# EAGLE schematic BE-Carrier-Example (EAGLE 7.7.0)
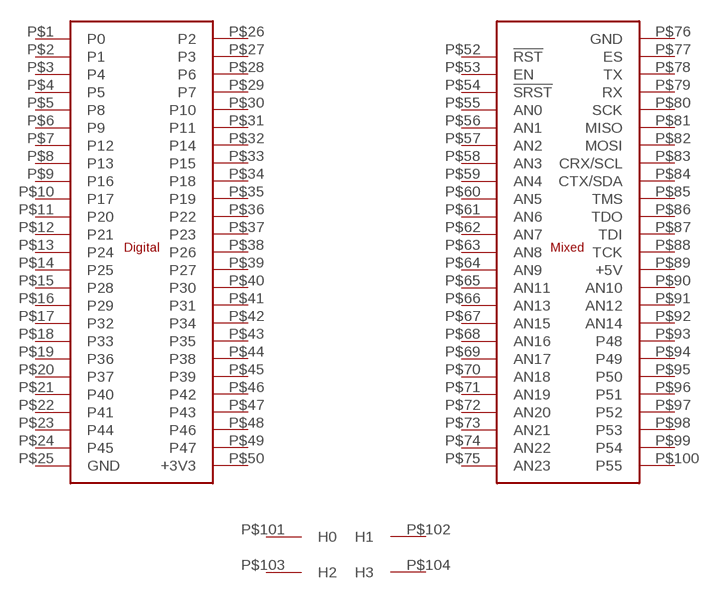
[diagram p0: schematic, sheet 1]

## Parts
U$1  BE-CARRIER  [BE-CARRIER]
Unconnected: U$1.P$1(P0) U$1.P$2(P1) U$1.P$3(P4) U$1.P$4(P5) U$1.P$5(P8) U$1.P$6(P9) U$1.P$7(P12) U$1.P$8(P13) U$1.P$9(P16) U$1.P$10(P17) U$1.P$11(P20) U$1.P$12(P21) U$1.P$13(P24) U$1.P$14(P25) U$1.P$15(P28) U$1.P$16(P29) U$1.P$17(P32) U$1.P$18(P33) U$1.P$19(P36) U$1.P$20(P37) U$1.P$21(P40) U$1.P$22(P41) U$1.P$23(P44) U$1.P$24(P45) U$1.P$25(GND) U$1.P$26(P2) U$1.P$27(P3) U$1.P$28(P6) U$1.P$29(P7) U$1.P$30(P10) U$1.P$31(P11) U$1.P$32(P14) U$1.P$33(P15) U$1.P$34(P18) U$1.P$35(P19) U$1.P$36(P22) U$1.P$37(P23) U$1.P$38(P26) U$1.P$39(P27) U$1.P$40(P30) U$1.P$41(P31) U$1.P$42(P34) U$1.P$43(P35) U$1.P$44(P38) U$1.P$45(P39) U$1.P$46(P42) U$1.P$47(P43) U$1.P$48(P46) U$1.P$49(P47) U$1.P$50(+3V3) U$1.P$51(NC) U$1.P$52(!RST) U$1.P$53(EN) U$1.P$54(!SRST) U$1.P$55(AN0) U$1.P$56(AN1) U$1.P$57(AN2) U$1.P$58(AN3) U$1.P$59(AN4) U$1.P$60(AN5) U$1.P$61(AN6) U$1.P$62(AN7) U$1.P$63(AN8) U$1.P$64(AN9) U$1.P$65(AN11) U$1.P$66(AN13) U$1.P$67(AN15) U$1.P$68(AN16) U$1.P$69(AN17) U$1.P$70(AN18) U$1.P$71(AN19) U$1.P$72(AN20) U$1.P$73(AN21) U$1.P$74(AN22) U$1.P$75(AN23) U$1.P$76(GND) U$1.P$77(ES) U$1.P$78(TX) U$1.P$79(RX) U$1.P$80(SCK) U$1.P$81(MISO) U$1.P$82(MOSI) U$1.P$83(CRX/SCL) U$1.P$84(CTX/SDA) U$1.P$85(TMS) U$1.P$86(TDO) U$1.P$87(TDI) U$1.P$88(TCK) U$1.P$89(+5V) U$1.P$90(AN10) U$1.P$91(AN12) U$1.P$92(AN14) U$1.P$93(P48) U$1.P$94(P49) U$1.P$95(P50) U$1.P$96(P51) U$1.P$97(P52) U$1.P$98(P53) U$1.P$99(P54) U$1.P$100(P55) U$1.P$101(H0) U$1.P$102(H1) U$1.P$103(H2) U$1.P$104(H3)

## Library data of the parts
U$1 = BlackEdge:BE-CARRIER